# EAGLE design Bottom_PCB (EAGLE 9.5.2)
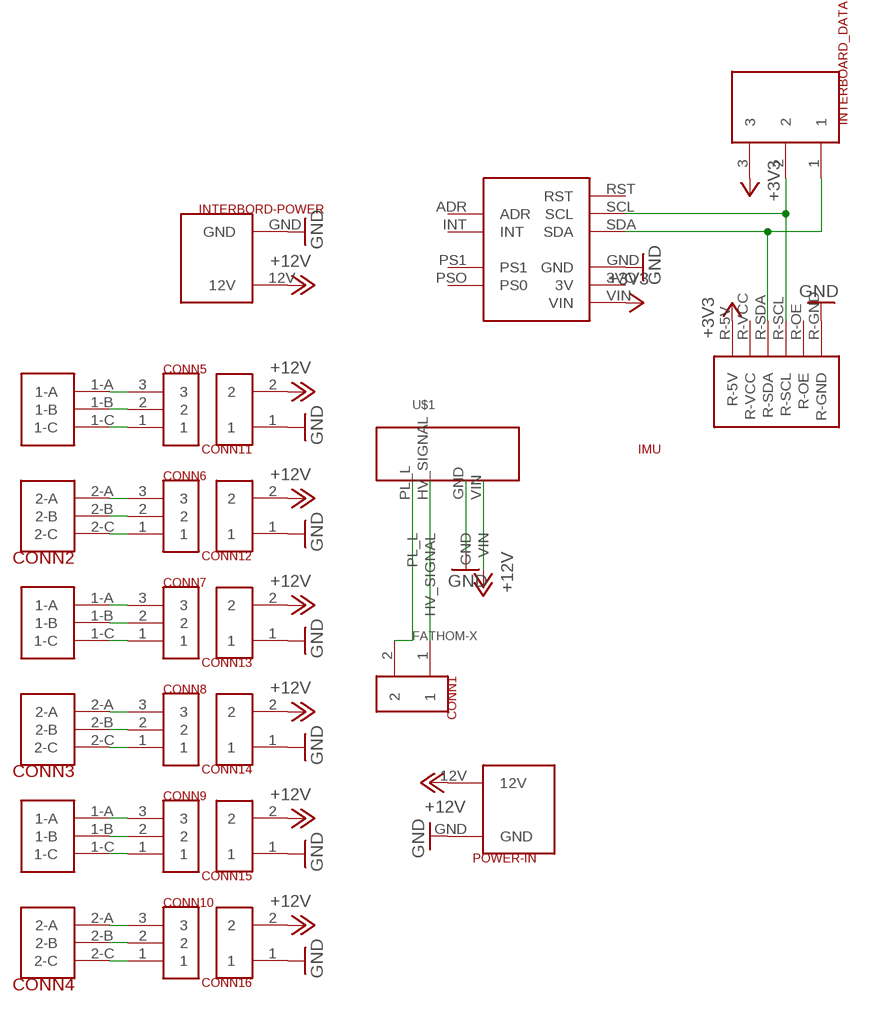
[diagram p0: schematic, sheet 1]

## Parts
CONN1  2CONTACT_ULTRAFIT_R/A  [2CONTAC_ULTRAFIT_R/A]
CONN2  6CONTACT_ULTRAFIT_R/A  [6CONTACT_ULTRAFIT_R/A]
CONN3  6CONTACT_ULTRAFIT_R/A  [6CONTACT_ULTRAFIT_R/A]
CONN4  6CONTACT_ULTRAFIT_R/A  [6CONTACT_ULTRAFIT_R/A]
CONN5  3CONTACT_ULTRAFIT_VERT  [3CONTAC_ULTRAFIT_VERT]
CONN6  3CONTACT_ULTRAFIT_VERT  [3CONTAC_ULTRAFIT_VERT]
CONN7  3CONTACT_ULTRAFIT_VERT  [3CONTAC_ULTRAFIT_VERT]
CONN8  3CONTACT_ULTRAFIT_VERT  [3CONTAC_ULTRAFIT_VERT]
CONN9  3CONTACT_ULTRAFIT_VERT  [3CONTAC_ULTRAFIT_VERT]
CONN10  3CONTACT_ULTRAFIT_VERT  [3CONTAC_ULTRAFIT_VERT]
CONN11  2CONTACT_ULTRAFIT_VERT  [2CONTAC_ULTRAFIT_VERT]
CONN12  2CONTACT_ULTRAFIT_VERT  [2CONTAC_ULTRAFIT_VERT]
CONN13  2CONTACT_ULTRAFIT_VERT  [2CONTAC_ULTRAFIT_VERT]
CONN14  2CONTACT_ULTRAFIT_VERT  [2CONTAC_ULTRAFIT_VERT]
CONN15  2CONTACT_ULTRAFIT_VERT  [2CONTAC_ULTRAFIT_VERT]
CONN16  2CONTACT_ULTRAFIT_VERT  [2CONTAC_ULTRAFIT_VERT]
IMU  IMU  [IMU]
INTERBOARD_DATA  3CONTAC_ULTRAFIT_R/A  [3CONTAC_ULTRAFIT_R/A]
INTERBORD-POWER  2-CONTACT-SUPER  [2-CONTACT-SUPER]
POWER-IN  2-CONTACT-SUPER  [2-CONTACT-SUPER]
PWM1  PWM_EXTENDER-SIMPLE  [PWM_EXTENDER-SIMPLE]
U$1  FATHOM-X  [FATHOM-X]

## Nets
+3V3 [PWM]: IMU.VIN INTERBOARD_DATA.3 PWM1.R-5V
+12V: CONN11.2 CONN12.2 CONN13.2 CONN14.2 CONN15.2 CONN16.2 INTERBORD-POWER.12V POWER-IN.12V U$1.VIN
GND: CONN11.1 CONN12.1 CONN13.1 CONN14.1 CONN15.1 CONN16.1 IMU.GND INTERBORD-POWER.GND POWER-IN.GND PWM1.R-GND U$1.GND
N$1: CONN2.1-A CONN5.3
N$2: CONN2.1-B CONN5.2
N$3: CONN2.1-C CONN5.1
N$4: CONN2.2-A CONN6.3
N$5: CONN2.2-B CONN6.2
N$6: CONN2.2-C CONN6.1
N$7: CONN3.1-A CONN7.3
N$8: CONN3.1-B CONN7.2
N$9: CONN3.1-C CONN7.1
N$10: CONN3.2-A CONN8.3
N$11: CONN3.2-B CONN8.2
N$12: CONN3.2-C CONN8.1
N$13: CONN1.2 U$1.PL_L
N$14: CONN1.1 U$1.HV_SIGNAL
N$15: CONN4.1-A CONN9.3
N$16: CONN4.1-B CONN9.2
N$17: CONN4.1-C CONN9.1
N$18: CONN4.2-A CONN10.3
N$19: CONN4.2-B CONN10.2
N$20: CONN4.2-C CONN10.1
N$37 [PWM]: IMU.SCL INTERBOARD_DATA.2 PWM1.R-SCL
N$38 [PWM]: IMU.SDA INTERBOARD_DATA.1 PWM1.R-SDA
Unconnected: IMU.3VO(3V) IMU.ADR IMU.INT IMU.PS1 IMU.PSO(PS0) IMU.RST PWM1.R-OE PWM1.R-VCC

## Library data of the parts
CONN1 = BlueShift:2CONTACT_ULTRAFIT_R/A
CONN2-CONN4 = BlueShift:6CONTACT_ULTRAFIT_R/A
CONN5-CONN10 = BlueShift:3CONTACT_ULTRAFIT_VERT
CONN11-CONN16 = BlueShift:2CONTACT_ULTRAFIT_VERT
IMU = BlueShift:IMU: adafruit.com/product/2472 github.com/adafruit/Adafruit-BNO055-Breakout-PCB
INTERBOARD_DATA = BlueShift:3CONTAC_ULTRAFIT_R/A: Molex 1723161112 12 Position (two Row) Ultra-Fit (14 A) Right Angle Connector Used in 2020 for Underwater Motor to ESC (Through the PCB) Connections Keep in mind you need the Contacts (the bits that get crimped on a wire) the Housing (the bits the contacts get shoved into) and this thing for it to work. Purchase: https://www.digikey.com/product-detail/en/molex/1723161112/WM11853-ND/5360318 Documentation: http://www.literature.molex.com/SQLImages/kelmscott/Molex/PDF_Images/987651-1008.pdf Technical Drawings: https://www.molex.com/pdm_docs/sd/1723161112_sd.pdf All Molex Connectors on Digikey: https://www.digikey.com/en/product-highlight/m/molex/power-connectors
INTERBORD-POWER POWER-IN = BlueShift:2-CONTACT-SUPER
PWM1 = BlueShift:PWM_EXTENDER-SIMPLE
U$1 = FathomX:FATHOM-X

## Net classes
1 PWM: width 0.254 mm
2 ESC: width 1.016 mm

## Board
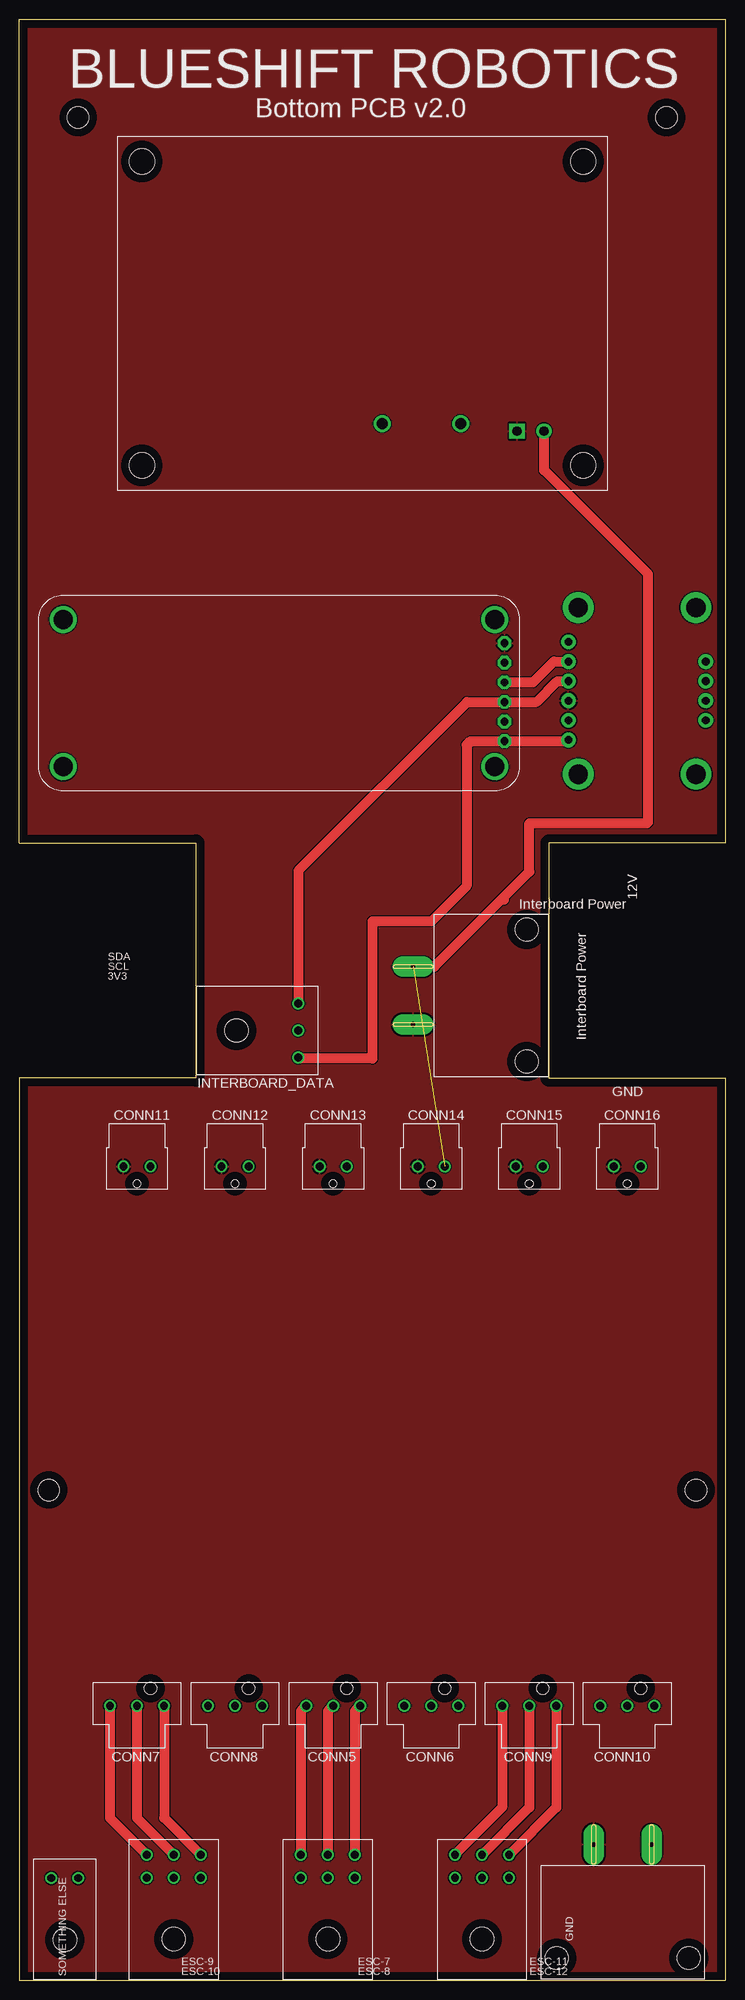
[diagram p1: board, top side]
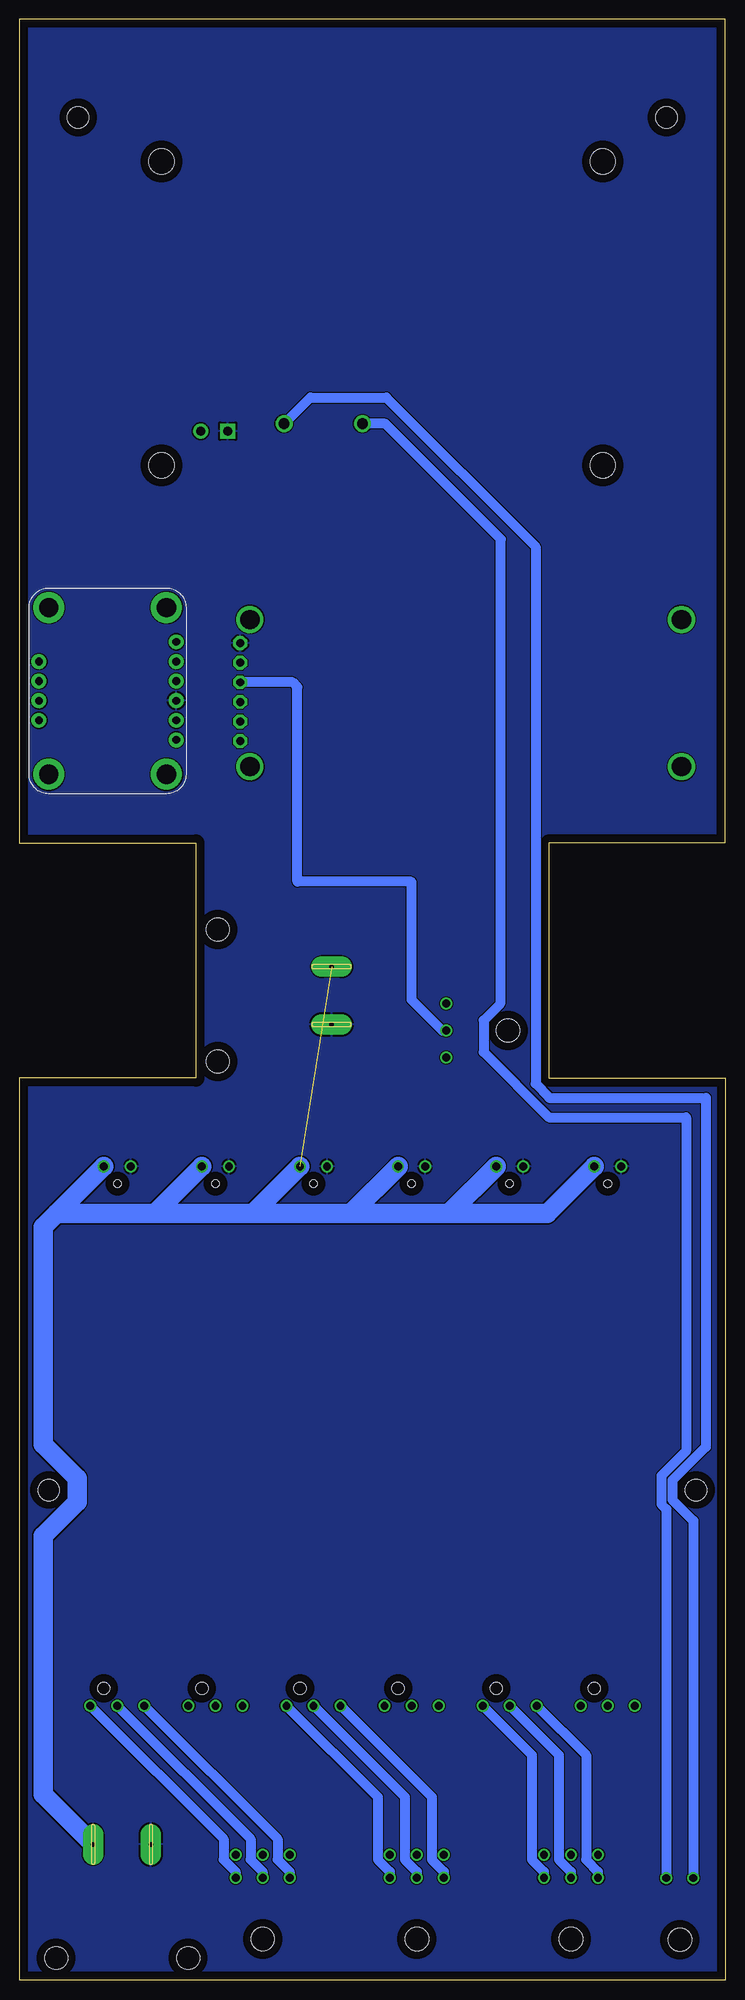
[diagram p2: board, bottom side, seen from below]

Size 91.44 x 254 mm. Coordinates in mm from the lower left corner, seen from the top.
Outline: 0,147.32 22.86,147.32 22.86,116.84 0,116.84 0,0 91.44,0 91.44,116.84 68.58,116.84 68.58,147.32 91.44,147.32 91.44,254 0,254 0,147.32
Copper layers (1*16): Top 0.035mm / dielectric 1.5mm / Bottom 0.035mm
Design rules "default *": minimum track width 6mil, minimum drill 0.35mm, track to track 6mil, track to pad 6mil, pad to pad 6mil, via to via 6mil, smd to smd 6mil, copper to edge 40mil, drill to drill 6mil, minimum pad ring 10mil, minimum via ring 8mil, stop-mask expansion 4mil, vias tented up to drill 0mil, thermal gap 10mil
Holes 2.79 mm at 83.82,241.3 7.62,241.3 87.63,63.5 3.81,63.5

### Footprints (pad centres in the part's own frame; a part is rotated, then mirrored left to right if it is on the bottom)
2CONTAC_ULTRAFIT_R/A = drill 1.02: 1 -1.75,-2.5; 2 1.75,-2.5 | hole 3.05: 0,-10.5
6CONTACT_ULTRAFIT_R/A = drill 1.02: 1-A -3.5,0; 1-B 0,0; 1-C 3.5,0; 2-A -3.5,-3; 2-B 0,-3; 2-C 3.5,-3 | hole 3.05: 0,-10.91
3CONTAC_ULTRAFIT_VERT = drill 1.02: 1 -3.5,0; 2 0,0; 3 3.5,0 | hole 1.6: -1.75,-2.23
2CONTAC_ULTRAFIT_VERT = drill 1.02: 1 -1.75,0; 2 1.75,0 | hole 1.02: 0,-2.23
IMU = drill 1 pad 1.93: 3VO 9.525,1.27; ADR 17.145,19.05; GND 12.065,1.27; INT 14.605,19.05; PS1 12.065,19.05; PSO 9.525,19.05; RST 19.685,1.27; SCL 17.145,1.27; SDA 14.605,1.27; VIN 6.985,1.27 | drill 2.5 pad 4: BLMOUNT 2.54,2.54; BRMOUNT 24.13,2.54; TLMOUNT 2.54,17.78; TRMOUNT 24.13,17.78
3CONTAC_ULTRAFIT_R/A = drill 1.02: 1 -3.5,-2.5; 2 0,-2.5; 3 3.5,-2.5 | hole 3.05: 0,-10.5
2-CONTACT-SUPER = drill 0.6 pad 2.65 long: 12V -12.29,-14.715; GND -4.8,-14.715 | hole 3: 0,0; -17.09,0
PWM_EXTENDER-SIMPLE = drill 2.489 pad 3.2: BLMOUNT 1.27,-3.302; BRMOUNT 57.15,-3.302; TLMOUNT 1.27,15.748; TRMOUNT 57.15,15.748 | drill 1.016 pad 1.778 octagon: R-5V 58.42,0; R-GND 58.42,12.7; R-OE 58.42,10.16; R-SCL 58.42,7.62; R-SDA 58.42,5.08; R-VCC 58.42,2.54
FATHOM-X = drill 1.2 pad 1.981 square: GND 51.752,7.62 | drill 1.397 pad 2.184: HV_SIGNAL 44.45,8.572; PL_L 34.29,8.572 | drill 1.2 pad 1.981: VIN 55.252,7.62 | hole 3.302: 3.175,42.545; 60.325,42.545; 60.325,3.175; 3.175,3.175

### Placement (x,y rotation side)
CONN1  5.9,15.74 0 top
CONN2  39.96,16.25 0 top
CONN3  20,16.25 0 top
CONN4  59.92,16.25 0 top
CONN5  40.64,35.56 180 top
CONN6  53.34,35.56 180 top
CONN7  15.24,35.56 180 top
CONN8  27.94,35.56 180 top
CONN9  66.04,35.56 180 top
CONN10  78.74,35.56 180 top
CONN11  15.24,105.41 0 top
CONN12  27.94,105.41 0 top
CONN13  40.64,105.41 0 top
CONN14  53.34,105.41 0 top
CONN15  66.04,105.41 0 top
CONN16  78.74,105.41 0 top
IMU  69.85,153.67 90 bottom
INTERBOARD_DATA  38.64,123.01 270 top
INTERBORD-POWER  65.72,119 270 top
POWER-IN  69.59,2.88 180 top
PWM1  4.42,160.5 0 top
U$1  12.7,193.04 0 top

### Tracks (layer width: path | path; a pad name or v marks a point on that pad's centre or on a via)
+3V3
  Top 1.27: IMU.VIN 70.97,160.5 PWM1.R-5V 58.42,160.5 57.92,160 57.92,141.74 53.34,137.16 45.72,137.16 45.72,119.38 36.27,119.38 INTERBOARD_DATA.3
+12V  (1 unrouted)
  Top 1.27: U$1.VIN 67.95,195.58 81.42,182.11 81.42,150 81.28,149.86 66.04,149.86 66.04,143.58 62.42,139.96 | 62.76,139.96 62.42,139.96 | 62.42,139.96 53.75,131.29 INTERBORD-POWER.12V
  Bottom 2.54: POWER-IN.12V 88.34,24.05 88.34,57.58 83.95,61.97 83.95,65.03 88.34,69.42 88.34,97.56 86.6,99.3 | 86.6,99.3 CONN16.2 | 86.6,99.3 73.9,99.3 | CONN15.2 73.9,99.3 | CONN14.2 61.2,99.3 | 73.9,99.3 61.2,99.3 | 61.2,99.3 48.5,99.3 | 48.5,99.3 CONN13.2 | 48.5,99.3 35.8,99.3 | 35.8,99.3 CONN12.2 | 35.8,99.3 23.1,99.3 CONN11.2
GND
  pour Top: -10.16,254 -10.16,-5.08 -5.08,-10.16 99.06,-10.16 101.6,-7.62 101.6,256.54 99.06,259.08 -5.08,259.08
  pour Bottom: -5.08,259.08 -10.16,254 -10.16,-5.08 -5.08,-10.16 99.06,-10.16 101.6,-7.62 101.6,256.54 99.06,259.08
N$1
  Top 1.27: CONN5.3 36.46,34.88 CONN2.1-A
N$2
  Top 1.27: CONN5.2 39.96,34.88 CONN2.1-B
N$3
  Top 1.27: CONN5.1 43.46,34.88 CONN2.1-C
N$4
  Bottom 1.27: CONN2.2-A 36.46,14.05 38.01,15.61 38.01,23.73 CONN6.3
N$5
  Bottom 1.27: CONN2.2-B 39.96,14.05 41.51,15.61 41.51,23.73 CONN6.2
N$6
  Bottom 1.27: CONN2.2-C 43.46,14.05 45.01,15.61 45.01,23.73 CONN6.1
N$7
  Top 1.27: CONN7.3 11.74,21.01 CONN3.1-A
N$8
  Top 1.27: CONN7.2 15.24,21.01 CONN3.1-B
N$9
  Top 1.27: CONN7.1 18.74,21.01 CONN3.1-C
N$10
  Bottom 1.27: CONN3.2-A 16.5,14.05 18.05,15.61 18.05,29.17 CONN8.3
N$11
  Bottom 1.27: CONN3.2-B 20,14.05 21.55,15.61 21.55,29.17 CONN8.2
N$12
  Bottom 1.27: CONN3.2-C 23.5,14.05 25.05,15.61 25.05,29.17 CONN8.1
N$13
  Bottom 1.27: U$1.PL_L 44.03,201.61 29.16,186.74 | 29.08,186.66 29.16,186.74 | 29.16,186.74 29.16,126.48 31.32,124.33 31.32,120.22 22.86,111.76 5.08,111.76 5.08,68.55 8.28,65.35 8.28,61.65 7.65,61.02 CONN1.2
N$14
  Bottom 1.27: U$1.HV_SIGNAL 53.76,205 43.92,205 24.59,185.67 24.59,116.12 22.86,114.4 22.86,114.3 2.54,114.3 2.54,69.08 6.86,64.76 6.86,62.24 4.15,59.53 CONN1.1
N$15
  Top 1.27: CONN9.3 62.54,22.37 CONN4.1-A
N$16
  Top 1.27: CONN9.2 66.04,22.37 CONN4.1-B
N$17
  Top 1.27: CONN9.1 69.54,22.37 CONN4.1-C
N$18
  Bottom 1.27: CONN10.3 57.97,18.29 57.97,15.61 56.42,14.05 CONN4.2-A
N$19
  Bottom 1.27: CONN10.2 61.47,18.29 61.47,15.61 59.92,14.05 CONN4.2-B
N$20
  Bottom 1.27: CONN10.1 64.97,18.29 64.97,15.61 63.42,14.05 CONN4.2-C
N$37
  Top 1.27: PWM1.R-SCL 66.54,168.12 69.23,170.81 IMU.SCL
  Bottom 1.27: PWM1.R-SCL 56.04,168.12 55.42,167.5 55.42,142.29 40.69,142.29 40.64,142.24 40.64,127 36.65,123.01 INTERBOARD_DATA.2
N$38
  Top 1.27: IMU.SDA 69.7,168.28 67,165.58 PWM1.R-SDA 58,165.58 36.14,143.72 INTERBOARD_DATA.1

### Text on the board
tNames: BLUESHIFT ROBOTICS | Bottom PCB v2.0 | 12V | Interboard Power | SDA | SCL | 3V3 | Interboard Power | GND | SOMETHING ELSE | HV-SIGNAL | GND | ESC-9 | ESC-7 | ESC-11 | ESC-10 | ESC-8 | ESC-12 | 12V